# Altium project Zond-Phono_Preamp.PrjPCB
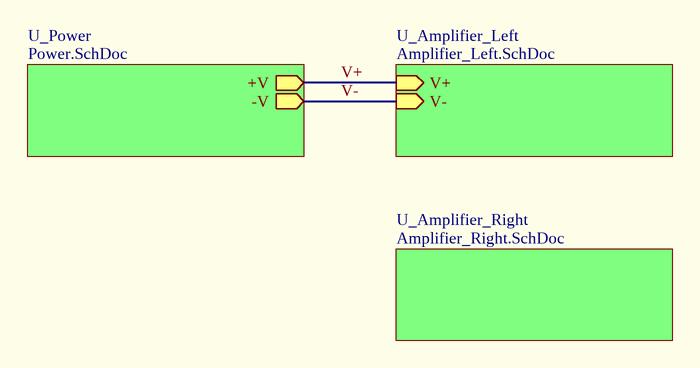
[diagram p0: Main.SchDoc]
4 sheets, 132 parts. Net scope: hierarchical (ports join the sheet entries above them; power ports are global).
Board file: ZondPhonoPreamp.PcbDoc
Sheets:
  Main.SchDoc
    U_Power = Power.SchDoc
    U_Amplifier_Left = Amplifier_Left.SchDoc
    U_Amplifier_Right = Amplifier_Right.SchDoc

## Sheet Main.SchDoc
size A4

### Sub-sheets
U_Amplifier_Left = Amplifier_Left.SchDoc: V+ (in), V- (in)
U_Amplifier_Right = Amplifier_Right.SchDoc: no entries
U_Power = Power.SchDoc: +V (out), -V (out)

### Nets
V+: sheet U_Power/+V, sheet U_Amplifier_Left/V+
V-: sheet U_Power/-V, sheet U_Amplifier_Left/V-

## Sheet Power.SchDoc
size A4
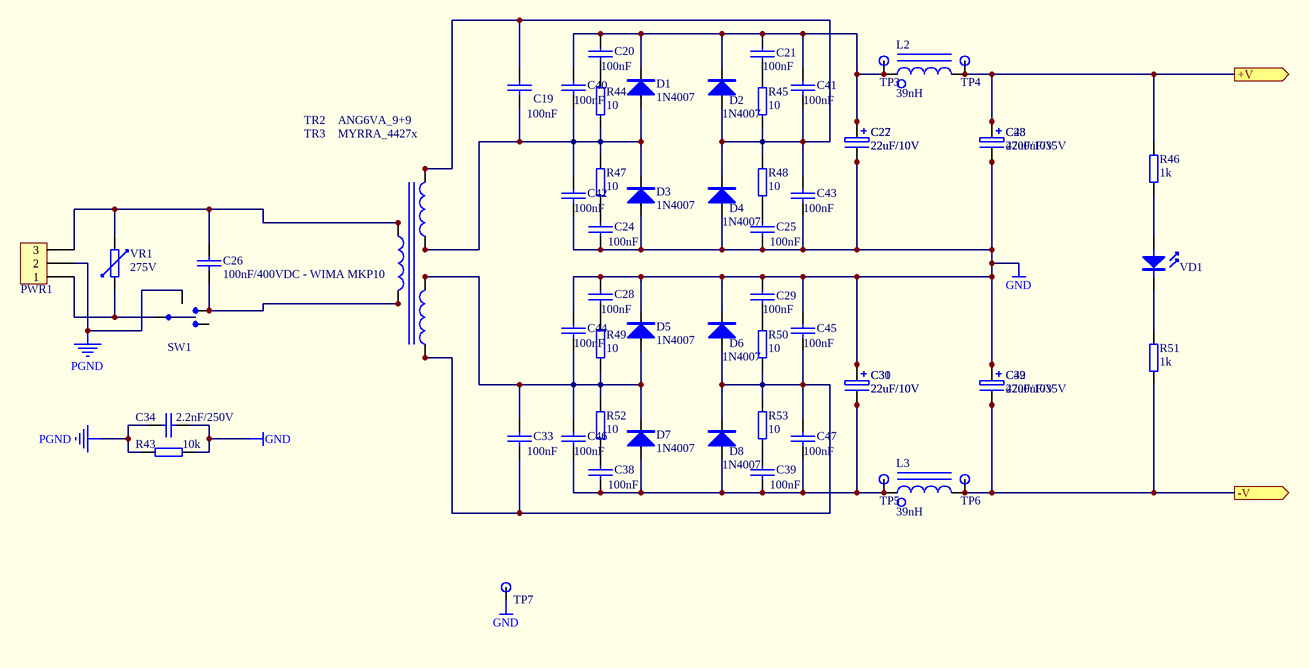
[diagram p1: Power.SchDoc]

### Parts
C19  100nF  [CAP_C200-1]
C20  100nF  [CAP_C200]
C21  100nF  [CAP_C200]
C22  22uF/10V  [CAP_EC10x20]
C23  4700uF/35V  [CAP_EC22x40]
C24  100nF  [CAP_C200]
C25  100nF  [CAP_C200]
C26  100nF/400VDC - WIMA MKP10  [CAP_5.7x10.3RM7.5]
C27  22uF/10V  [CAP_EC22x40]
C28  100nF  [CAP_C200]
C29  100nF  [CAP_C200]
C30  22uF/10V  [CAP_EC10x20]
C31  22uF/10V  [CAP_EC22x40]
C32  4700uF/35V  [CAP_EC22x40]
C33  100nF  [CAP_C200-1]
C34  2.2nF/250V  [CAP_5.7x10.3RM7.5]
C38  100nF  [CAP_C200]
C39  100nF  [CAP_C200]
C40  100nF  [CAP_C200]
C41  100nF  [CAP_C200]
C42  100nF  [CAP_C200]
C43  100nF  [CAP_C200]
C44  100nF  [CAP_C200]
C45  100nF  [CAP_C200]
C46  100nF  [CAP_C200]
C47  100nF  [CAP_C200]
C48  22uF/10V  [CAP_EC10x20]
C49  22uF/10V  [CAP_EC10x20]
D1  1N4007  [DIODE_D400]
D2  1N4007  [DIODE_D400]
D3  1N4007  [DIODE_D400]
D4  1N4007  [DIODE_D400]
D5  1N4007  [DIODE_D400]
D6  1N4007  [DIODE_D400]
D7  1N4007  [DIODE_D400]
D8  1N4007  [DIODE_D400]
L2  39nH  [IND_SRI1205]
L3  39nH  [IND_SRI1205]
PWR1  CON3  [CON_TOP_3P]  (value not drawn)
R43  10k  [RES_R400]
R44  10  [RES_R400]
R45  10  [RES_R400]
R46  1k  [RES_R400]
R47  10  [RES_R400]
R48  10  [RES_R400]
R49  10  [RES_R400]
R50  10  [RES_R400]
R51  1k  [RES_R400]
R52  10  [RES_R400]
R53  10  [RES_R400]
SW1  SW  [SW_250VAC1.5A]  (value not drawn)
TP3  TESTPAD  [MISC_PAD-36/65]  (value not drawn)
TP4  TESTPAD  [MISC_PAD-36/65]  (value not drawn)
TP5  TESTPAD  [MISC_PAD-36/65]  (value not drawn)
TP6  TESTPAD  [MISC_PAD-36/65]  (value not drawn)
TP7  TESTPAD  [MISC_PAD-36/65]  (value not drawn)
TR2  ANG6VA_9+9  [TRAF_ANG6VA]
TR3  MYRRA_4427x  [TRAF_MYRRA_10VA]
VD1  LED  [LED_5MM]  (value not drawn)
VR1  275V  [MISC_Varistor]

### Ports
+V (out), -V (out)

### Nets
GND: C22.2 C23.2 C24.2 C25.2 C27.2 C28.1 C29.1 C30.1 C31.1 C32.1 C34.2 C42.2 C43.2 C44.1 C45.1 C48.2 C49.1 D3.1(A) D4.1(A) D5.2(K) D6.2(K) R43.2 TP7.1
PGND: C34.1 PWR1.2 R43.1 SW1.0
V+: C23.1 C48.1 L2.2 R46.2 TP4.1 ; port +V
V-: C32.2 C49.2 L3.2 R51.1 TP6.1 ; port -V
NetC19_1: C19.1 C41.2 C43.1 D2.1(A) D4.2(K) R45.1 R48.2 TR2.10 TR3.12
NetC19_2: C19.2 C40.2 C42.1 D1.1(A) D3.2(K) R44.1 R47.2 TR2.9 TR3.11
NetC20_1: C20.1 C21.1 C22.1 C27.1 C40.1 C41.1 D1.2(K) D2.2(K) L2.1 TP3.1
NetC20_2: C20.2 R44.2
NetC21_2: C21.2 R45.2
NetC24_1: C24.1 R47.1
NetC25_1: C25.1 R48.1
NetC26_1: C26.1 SW1.3 TR2.1 TR3.6
NetC26_2: C26.2 PWR1.3 TR2.5 TR3.1 VR1.1
NetC28_2: C28.2 R49.2
NetC29_2: C29.2 R50.2
NetC30_2: C30.2 C31.2 C38.2 C39.2 C46.2 C47.2 D7.1(A) D8.1(A) L3.1 TP5.1
NetC33_1: C33.1 C44.2 C46.1 D5.1(A) D7.2(K) R49.1 R52.2 TR2.7 TR3.8
NetC33_2: C33.2 C45.2 C47.1 D6.1(A) D8.2(K) R50.1 R53.2 TR2.6 TR3.7
NetC38_1: C38.1 R52.1
NetC39_1: C39.1 R53.1
NetPWR1_1: PWR1.1 SW1.2 VR1.2
NetR46_1: R46.1 VD1.1(A1)
NetR51_2: R51.2 VD1.2(K)

Not connected (* = marked no-connect by the designer): SW1 1

### Library data of the parts
C19-C21 C24-C26 C28 C29 C33 C34 C38-C47 = CAP: Capacitor
C22 C23 C27 C30-C32 C48 C49 = ELECTRO1: Electrolytic Capacitor
D1-D8 = DIODE
L2 L3 = INDUCTOR IRON1
PWR1 = CON3: Connector
R43-R53 = RES: Resistor
SW1 = SW_2WAY
TR2 = TRAF_ANG6VAx+x
TR3 = TRAF_MYRRA_10VA_D
VD1 = LED: LED, 3mm
VR1 = VARISTOR: Resistor

## Sheet Amplifier_Left.SchDoc
size A4
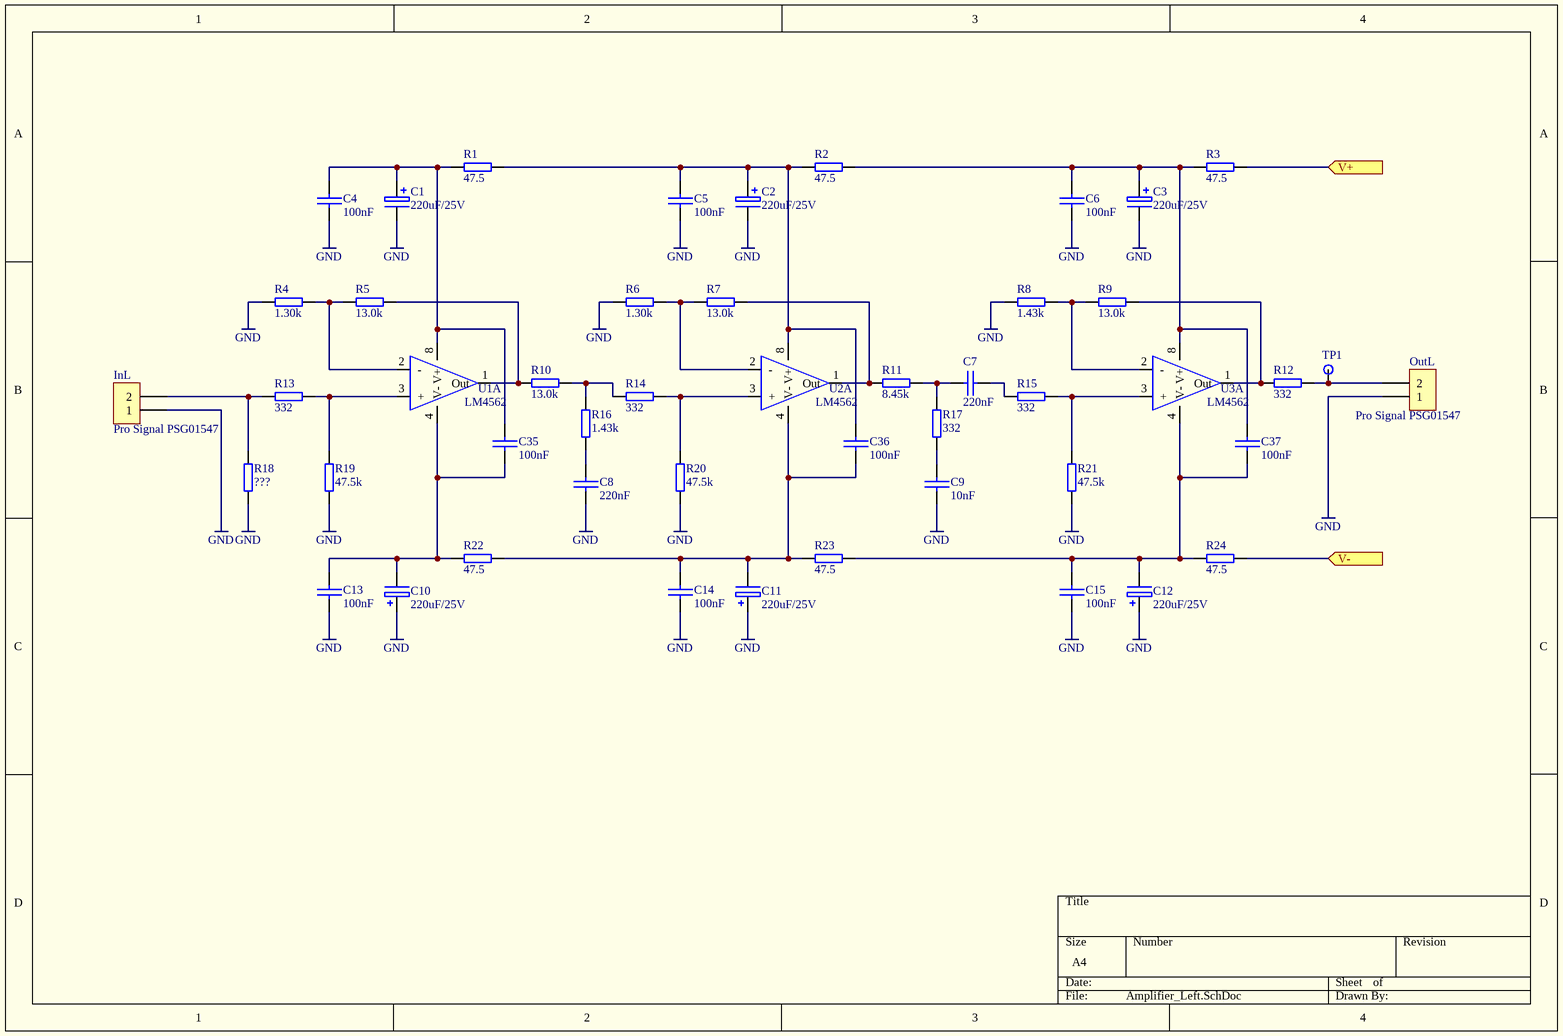
[diagram p2: Amplifier_Left.SchDoc]

### Parts
C1  220uF/25V  [CAP_EC8x16]
C2  220uF/25V  [CAP_EC8x16]
C3  220uF/25V  [CAP_EC8x16]
C4  100nF  [CAP_C200]
C5  100nF  [CAP_C200]
C6  100nF  [CAP_C200]
C7  220nF  [CAP_C200-1]
C8  220nF  [CAP_C200-1]
C9  10nF  [CAP_C200]
C10  220uF/25V  [CAP_EC8x16]
C11  220uF/25V  [CAP_EC8x16]
C12  220uF/25V  [CAP_EC8x16]
C13  100nF  [CAP_C200]
C14  100nF  [CAP_C200]
C15  100nF  [CAP_C200]
C35  100nF  [CAP_C200]
C36  100nF  [CAP_C200]
C37  100nF  [CAP_C200]
InL  Pro Signal PSG01547  [CON_RCA_PSG01547]
OutL  Pro Signal PSG01547  [CON_RCA_PSG01547]
R1  47.5  [RES_R400]
R2  47.5  [RES_R400]
R3  47.5  [RES_R400]
R4  1.30k  [RES_R400]
R5  13.0k  [RES_R400]
R6  1.30k  [RES_R400]
R7  13.0k  [RES_R400]
R8  1.43k  [RES_R400]
R9  13.0k  [RES_R400]
R10  13.0k  [RES_R400]
R11  8.45k  [RES_R400]
R12  332  [RES_R400]
R13  332  [RES_R400]
R14  332  [RES_R400]
R15  332  [RES_R400]
R16  1.43k  [RES_R400]
R17  332  [RES_R400]
R18  ???  [RES_R400]
R19  47.5k  [RES_R400]
R20  47.5k  [RES_R400]
R21  47.5k  [RES_R400]
R22  47.5  [RES_R400]
R23  47.5  [RES_R400]
R24  47.5  [RES_R400]
TP1  TESTPAD  [MISC_PAD-36/65]  (value not drawn)
U1  LM4562  [IC_DIP-8]  (part A of 2)
U2  LM4562  [IC_DIP-8]  (part A of 2)
U3  LM4562  [IC_DIP-8]  (part A of 2)

### Ports
V+ (in), V- (in)

### Nets
GND: C1.2 C2.2 C3.2 C4.2 C5.2 C6.2 C8.2 C9.2 C10.1 C11.1 C12.1 C13.2 C14.2 C15.2 InL.1 OutL.1 R4.2 R6.2 R8.2 R18.1 R19.2 R20.2 R21.2
V+: R3.1 ; port V+
V-: R24.1 ; port V-
NetC1_1: C1.1 C4.1 C35.1 R1.2 U1.8(V+)
NetC2_1: C2.1 C5.1 C36.1 R1.1 R2.2 U2.8(V+)
NetC3_1: C3.1 C6.1 C37.1 R2.1 R3.2 U3.8(V+)
NetC7_1: C7.1 R11.1 R17.1
NetC7_2: C7.2 R15.2
NetC8_1: C8.1 R16.2
NetC9_1: C9.1 R17.2
NetC10_2: C10.2 C13.1 C35.2 R22.2 U1.4(V-)
NetC11_2: C11.2 C14.1 C36.2 R22.1 R23.2 U2.4(V-)
NetC12_2: C12.2 C15.1 C37.2 R23.1 R24.2 U3.4(V-)
NetInL_2: InL.2 R13.2 R18.2
NetOutL_2: OutL.2 R12.1 TP1.1
NetR4_1: R4.1 R5.2 U1.2(-)
NetR5_1: R5.1 R10.2 U1.1(Out)
NetR6_1: R6.1 R7.2 U2.2(-)
NetR7_1: R7.1 R11.2 U2.1(Out)
NetR8_1: R8.1 R9.2 U3.2(-)
NetR9_1: R9.1 R12.2 U3.1(Out)
NetR10_1: R10.1 R14.2 R16.1
NetR13_1: R13.1 R19.1 U1.3(+)
NetR14_1: R14.1 R20.1 U2.3(+)
NetR15_1: R15.1 R21.1 U3.3(+)

### Library data of the parts
C1-C3 C10-C12 = ELECTRO1: Electrolytic Capacitor
C4-C9 C13-C15 C35-C37 = CAP: Capacitor
InL OutL = CON2: Connector
R1-R24 = RES: Resistor
U1-U3 = OPAMP_Dual: standard dual op-amp

## Sheet Amplifier_Right.SchDoc
size A4
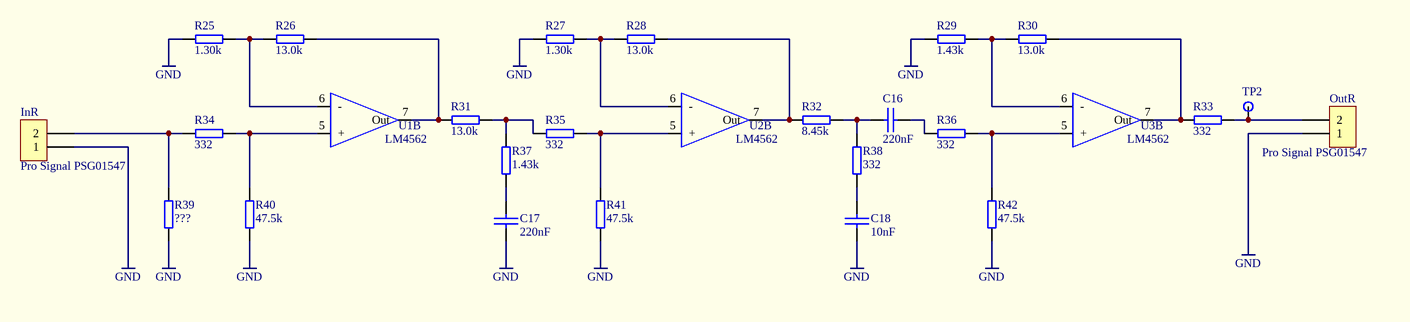
[diagram p3: Amplifier_Right.SchDoc]

### Parts
C16  220nF  [CAP_C200-1]
C17  220nF  [CAP_C200-1]
C18  10nF  [CAP_C200]
InR  Pro Signal PSG01547  [CON_RCA_PSG01547]
OutR  Pro Signal PSG01547  [CON_RCA_PSG01547]
R25  1.30k  [RES_R400]
R26  13.0k  [RES_R400]
R27  1.30k  [RES_R400]
R28  13.0k  [RES_R400]
R29  1.43k  [RES_R400]
R30  13.0k  [RES_R400]
R31  13.0k  [RES_R400]
R32  8.45k  [RES_R400]
R33  332  [RES_R400]
R34  332  [RES_R400]
R35  332  [RES_R400]
R36  332  [RES_R400]
R37  1.43k  [RES_R400]
R38  332  [RES_R400]
R39  ???  [RES_R400]
R40  47.5k  [RES_R400]
R41  47.5k  [RES_R400]
R42  47.5k  [RES_R400]
TP2  TESTPAD  [MISC_PAD-36/65]  (value not drawn)
U1  LM4562  [IC_DIP-8]  (part B of 2)
U2  LM4562  [IC_DIP-8]  (part B of 2)
U3  LM4562  [IC_DIP-8]  (part B of 2)

### Nets
GND: C17.2 C18.2 InR.1 OutR.1 R25.2 R27.2 R29.2 R39.1 R40.2 R41.2 R42.2
NetC16_1: C16.1 R32.1 R38.1
NetC16_2: C16.2 R36.2
NetC17_1: C17.1 R37.2
NetC18_1: C18.1 R38.2
NetInR_2: InR.2 R34.2 R39.2
NetOutR_2: OutR.2 R33.1 TP2.1
NetR25_1: R25.1 R26.2 U1.6(-)
NetR26_1: R26.1 R31.2 U1.7(Out)
NetR27_1: R27.1 R28.2 U2.6(-)
NetR28_1: R28.1 R32.2 U2.7(Out)
NetR29_1: R29.1 R30.2 U3.6(-)
NetR30_1: R30.1 R33.2 U3.7(Out)
NetR31_1: R31.1 R35.2 R37.1
NetR34_1: R34.1 R40.1 U1.5(+)
NetR35_1: R35.1 R41.1 U2.5(+)
NetR36_1: R36.1 R42.1 U3.5(+)

### Library data of the parts
C16-C18 = CAP: Capacitor
InR OutR = CON2: Connector
R25-R42 = RES: Resistor
U1-U3 = OPAMP_Dual: standard dual op-amp

## Nets that join several sheets
GND: Power (23 pins), Amplifier_Left (23 pins), Amplifier_Right (11 pins)
V+: Power (5 pins), Amplifier_Left (R3.1)
V-: Power (5 pins), Amplifier_Left (R24.1)